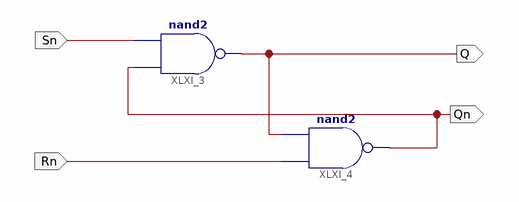
[diagram p0: schematic sheet 1]
// Xilinx ISE schematic RS_NAND.sch (spartan3) as structural Verilog: 2 symbols, 4 ports
module RS_NAND (
  input  Rn,
  input  Sn,
  output Qn,
  output Q
);

  nand XLXI_3 (Q, Qn, Sn);
  nand XLXI_4 (Qn, Rn, Q);
endmodule
